# Altium schematic sheet SM1.SchDoc
size A
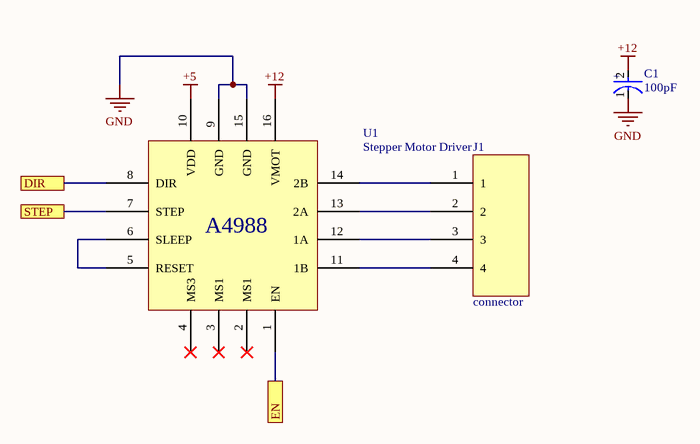
[diagram p0: SM1.SchDoc]

## Parts
C1  100pF  [FP-SC-MFG]
J1  connector  [JST_4P]
U1  Stepper Motor Driver  [A4988]

## Ports
DIR, EN, STEP

## Nets
+5: U1.10(VDD)
+12: C1.2(A) U1.16(VMOT)
GND: C1.1(C) U1.9(GND) U1.15(GND)
DIR: U1.8(DIR) ; port DIR
EN: U1.1(EN) ; port EN
STEP: U1.7(STEP) ; port STEP
NetJ1_1: J1.1 U1.14(2B)
NetJ1_2: J1.2 U1.13(2A)
NetJ1_3: J1.3 U1.12(1A)
NetJ1_4: J1.4 U1.11(1B)
NetU1_5: U1.5(RESET) U1.6(SLEEP)

Not connected (* = marked no-connect by the designer): U1 2(MS1)* 3(MS1)* 4(MS3)*

## Notes on the sheet
- (in symbol CMP-05427-000087-1) +

## Library data of the parts
C1 = CMP-05427-000087-1: CAP ALUM 10UF 20% 35V SMD; Life (Hours): 2000Hour; Lead Length: 2.2mm; Ripple Current (AC): 30mA; Leakage Current: 3uA; Length: 5.5mm; Construction: Cylindrical; Diameter: 5mm; RoHS Compliant: Yes; REACH SVHC: No SVHC; Capacitance: 10uF; Max Operating Temperature: 85°C; Series: S; Case/Package: Radial; Contact Plating: Tin; Packaging: Tape and Reel; Voltage Rating: 35V; Number of Pins: 2; Height: 5.4mm; Width: 5.3mm; Voltage Rating (DC): 35V; Mount: Surface Mount; Tolerance: 20%; Lead Pitch: 1.5mm; Radiation Hardening: No; Height - Seated (Max): 0.213inch; Ripple Current: 30mA; Voltage: 35V; Package Quantity: 1; Termination: SMD/SMT; Min Operating Temperature: -40°C
J1 = JST_4P
U1 = A4988